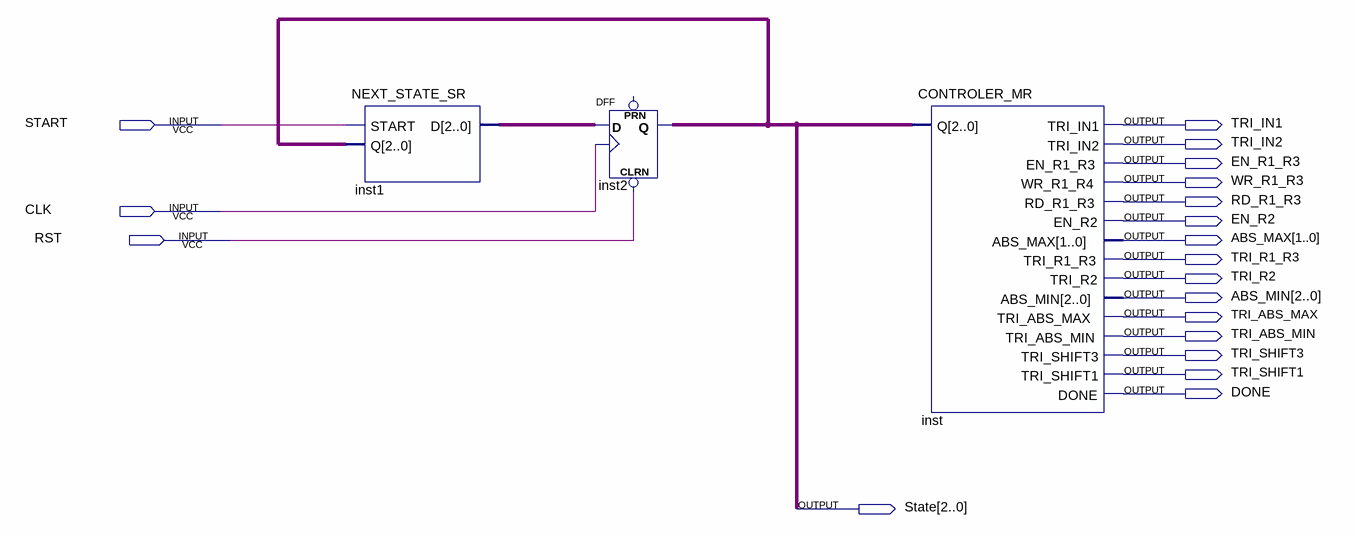
[diagram p0: schematic sheet]
// Quartus schematic CONTROL_MRR.bdf as structural Verilog: 3 symbols, 19 pins
module CONTROL_MRR (
  input  START,
  input  CLK,
  input  RST,
  output TRI_IN1,
  output TRI_IN2,
  output EN_R1_R3,
  output WR_R1_R3,
  output RD_R1_R3,
  output EN_R2,
  output [1:0] ABS_MAX,
  output TRI_R1_R3,
  output TRI_R2,
  output [2:0] ABS_MIN,
  output TRI_ABS_MAX,
  output TRI_ABS_MIN,
  output TRI_SHIFT3,
  output TRI_SHIFT1,
  output DONE,
  output [2:0] State
);

  wire [2:0] inst1_d;

  NEXT_STATE_SR inst1 (.START(START), .Q(State), .D(inst1_d));
  DFF inst2[2:0] (.CLRN(RST), .CLK(CLK), .D(inst1_d), .Q(State));  // open: PRN
  CONTROLER_MR inst (
    .Q(State), .TRI_IN1(TRI_IN1), .TRI_IN2(TRI_IN2), .EN_R1_R3(EN_R1_R3), .WR_R1_R4(WR_R1_R3),
    .RD_R1_R3(RD_R1_R3), .EN_R2(EN_R2), .ABS_MAX(ABS_MAX), .TRI_R1_R3(TRI_R1_R3), .TRI_R2(TRI_R2),
    .ABS_MIN(ABS_MIN), .TRI_ABS_MAX(TRI_ABS_MAX), .TRI_ABS_MIN(TRI_ABS_MIN), .TRI_SHIFT3(TRI_SHIFT3),
    .TRI_SHIFT1(TRI_SHIFT1), .DONE(DONE));
endmodule
